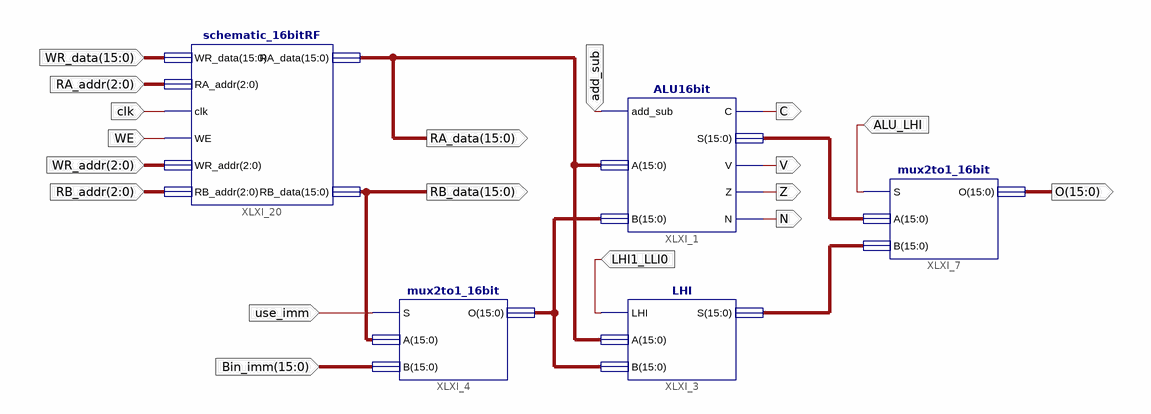
[diagram p0: schematic sheet 1]
// Xilinx ISE schematic RF_ALU.sch (spartan6) as structural Verilog: 5 symbols, 18 ports
module RF_ALU (
  input  add_sub,
  input  use_imm,
  input  [15:0] Bin_imm,
  input  LHI1_LLI0,
  input  ALU_LHI,
  input  clk,
  input  WE,
  input  [2:0] WR_addr,
  input  [2:0] RB_addr,
  input  [2:0] RA_addr,
  input  [15:0] WR_data,
  output C,
  output V,
  output Z,
  output N,
  output [15:0] RA_data,
  output [15:0] O,
  output [15:0] RB_data
);

  wire [15:0] XLXN_1, XLXN_2, XLXN_52;

  mux2to1_16bit XLXI_7 (.S(ALU_LHI), .A(XLXN_1), .B(XLXN_2), .O(O));
  ALU16bit XLXI_1 (.add_sub(add_sub), .A(RA_data), .B(XLXN_52), .C(C), .S(XLXN_1), .V(V), .Z(Z), .N(N));
  LHI XLXI_3 (.LHI(LHI1_LLI0), .A(RA_data), .B(XLXN_52), .S(XLXN_2));
  mux2to1_16bit XLXI_4 (.S(use_imm), .A(RB_data), .B(Bin_imm), .O(XLXN_52));
  schematic_16bitRF XLXI_20 (
    .WR_data(WR_data), .RA_addr(RA_addr), .clk(clk), .WE(WE), .WR_addr(WR_addr), .RB_addr(RB_addr),
    .RA_data(RA_data), .RB_data(RB_data));
endmodule
